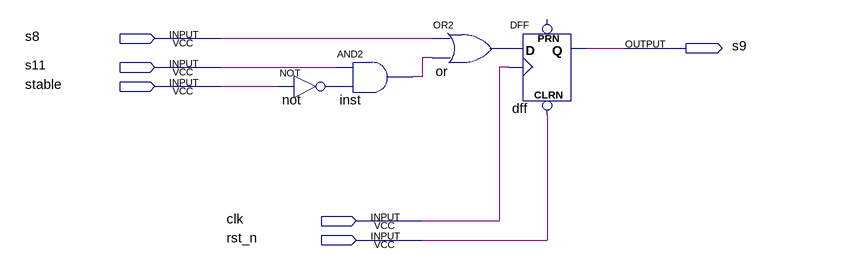
[diagram p0: schematic sheet]
// Quartus schematic s9.bdf as structural Verilog: 4 symbols, 6 pins
module s9 (
  input  s8,
  input  s11,
  input  stable,
  input  clk,
  input  rst_n,
  output s9
);

  wire inst_out, not_out, or_out;

  not \not  (not_out, stable);
  and inst (inst_out, s11, not_out);
  or \or  (or_out, s8, inst_out);
  DFF dff (.CLRN(rst_n), .CLK(clk), .D(or_out), .Q(s9));  // open: PRN
endmodule
